# EAGLE design PlungerV3R7A (15cm x 2.5cm) (EAGLE 6.2)
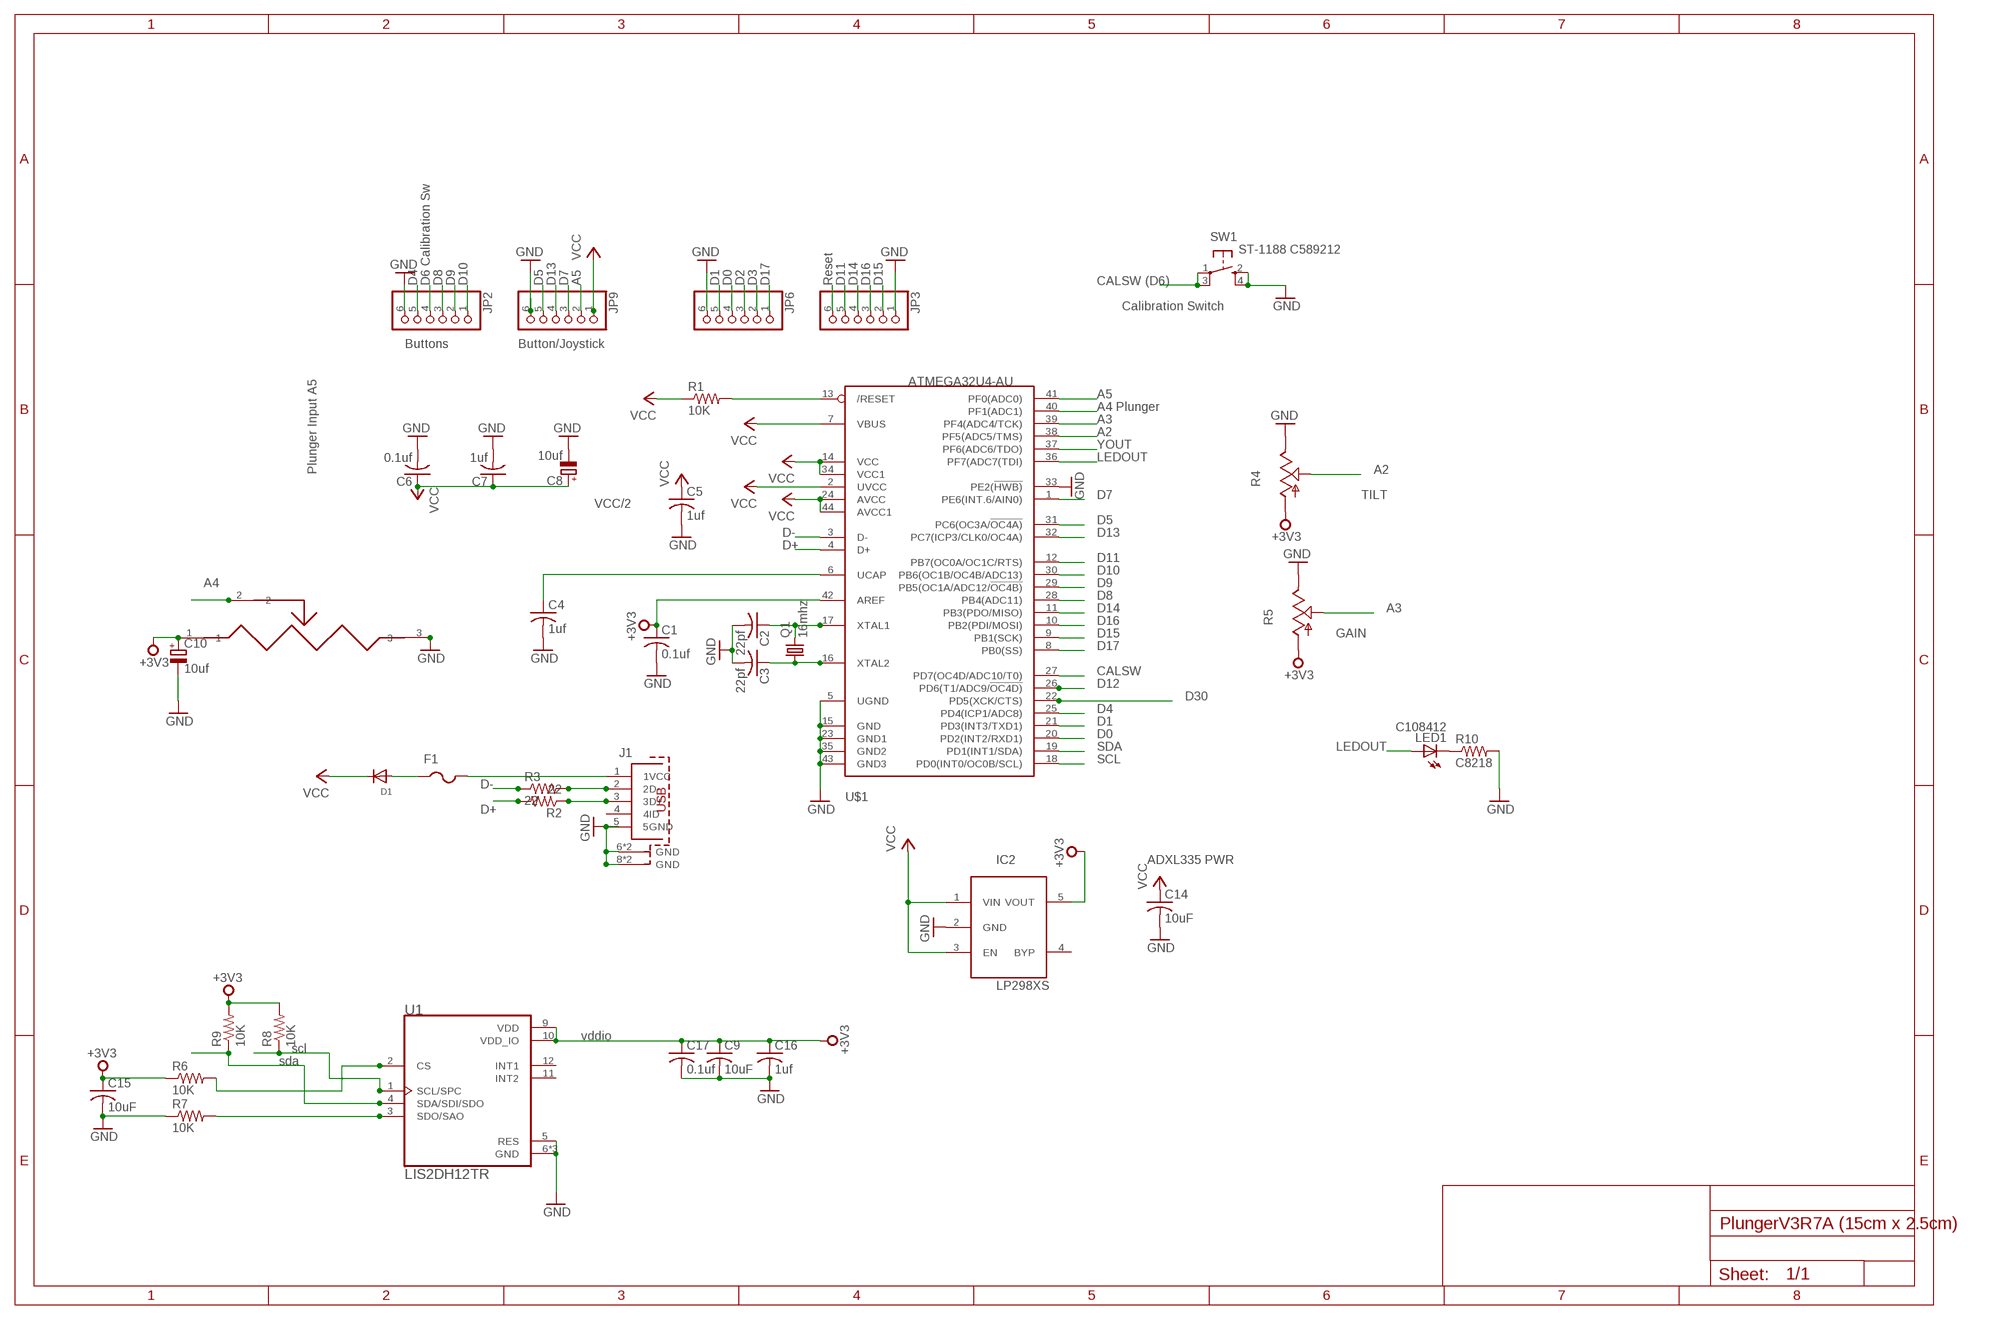
[diagram p0: schematic, sheet 1]

## Parts
C1  0.1uf  C-USC0603  [C0603]
C2  22pf  C-USC0603  [C0603]
C3  22pf  C-USC0603  [C0603]
C4  1uf  C-USC0603  [C0603]
C5  1uf  C-USC0603  [C0603]
C6  0.1uf  C-USC0603  [C0603]
C7  1uf  C-USC0603  [C0603]
C8  10uf  CPOL-EUA/3216-18W  [A/3216-18W]
C9  10uF  C-USC0805K  [C0805K]
C10  10uf  CPOL-EUA/3216-18W  [A/3216-18W]
C14  10uF  C-USC0805K  [C0805K]
C15  10uF  C-USC0805K  [C0805K]
C16  1uf  C-USC0603  [C0603]
C17  0.1uf  C-USC0603  [C0603]
D1  DIODESMA  [SMADIODE]
F1  PTCFUSE-1812  [1812]
IC2  LP298XS  [SOT23-5L]
J1  651005136521  [651005136521]
JP2  PINHD-1X6B  [1X06-BIG]
JP3  PINHD-1X6B  [1X06-BIG]
JP6  PINHD-1X6B  [1X06-BIG]
JP9  PINHD-1X6B  [1X06-BIG]
LED1  C108412  LEDCHIP-LED0805  [CHIP-LED0805]
Q1  16mhz  CRYSTALCTS406  [CTS406]
R1  10K  R-US_M0805  [M0805]
R2  22  R-US_R0603  [R0603]
R3  22  R-US_R0603  [R0603]
R4  TRIM_US-B25P  [B25P]
R5  TRIM_US-B25P  [B25P]
R6  10K  R-US_R0805  [R0805]
R7  10K  R-US_R0603  [R0603]
R8  10K  R-US_R0603  [R0603]
R9  10K  R-US_R0603  [R0603]
R10  C8218  R-US_M0805  [M0805]
SW1  ST-1188 C589212  SPST_TACT-KMR2  [KMR2]
U1  LIS2DH12TR  [PQFN50P200X200100-12N]
U$1  ATMEGA32U4-AU  [TQFP44]
U$7  PS100POTENTIOMETER  [PS100]

## Nets
+3V3: C1.1 C9.1 C10.+ C15.1 C16.1 C17.1 IC2.5(VOUT) R4.A R5.A R6.1 R8.2 R9.2 U1.9(VDD) U1.10(VDD_IO) U$1.42(AREF) U$7.1
A2: R4.S U$1.38(PF5(ADC5/TMS))
A3: R5.S U$1.39(PF4(ADC4/TCK))
A4: U$1.40(PF1(ADC1)) U$7.2
A5: JP9.2 U$1.41(PF0(ADC0))
CALSW: JP2.4 SW1.1(P) SW1.3(P1) U$1.27(PD7(OC4D/ADC10/T0))
D0: JP6.4 U$1.20(PD2(INT2/RXD1))
D1: JP6.5 U$1.21(PD3(INT3/TXD1))
D4: JP2.5 U$1.25(PD4(ICP1/ADC8))
D5: JP9.5 U$1.31(PC6(OC3A/!OC4A))
D7: JP9.3 U$1.1(PE6(INT.6/AIN0))
D8: JP2.3 U$1.28(PB4(ADC11))
D9: JP2.2 U$1.29(PB5(OC1A/ADC12/!OC4B))
D10: JP2.1 U$1.30(PB6(OC1B/OC4B/ADC13))
D11: JP3.5 U$1.12(PB7(OC0A/OC1C/RTS))
D12: U$1.26(PD6(T1/ADC9/!OC4D))
D13: JP9.4 U$1.32(PC7(ICP3/CLK0/OC4A))
D14: JP3.4 U$1.11(PB3(PDO/MISO))
D15: JP3.2 U$1.9(PB1(SCK))
D16: JP3.3 U$1.10(PB2(PDI/MOSI))
D17: JP6.1 U$1.8(PB0(SS))
D30: U$1.22(PD5(XCK/CTS))
D+: R2.2 U$1.4(D+)
D-: R3.1 U$1.3(D-)
GND: C1.2 C2.2 C3.2 C4.2 C5.2 C6.2 C7.2 C8.- C9.2 C10.- C14.2 C15.2 C16.2 C17.2 IC2.2(GND) J1.5(5GND) J1.6(GND) J1.7(GND) J1.8(GND) J1.9(GND) JP2.6 JP3.1 JP6.6 JP9.6 R4.E R5.E R7.1 R10.2 SW1.2(S) SW1.4(S1) U1.5(RES) U1.6(GND) U1.7(GND) U1.8(GND) U$1.5(UGND) U$1.15(GND) U$1.23(GND1) U$1.33(PE2(!HWB)) U$1.35(GND2) U$1.43(GND3) U$7.3
LEDOUT: LED1.A U$1.36(PF7(ADC7(TDI))
N$1: R7.2 U1.3(SDO/SAO)
N$2: C2.1 Q1.3 U$1.17(XTAL1)
N$3: C3.1 Q1.1 U$1.16(XTAL2)
N$4: J1.3(3D+) R2.1
N$5: C4.1 U$1.6(UCAP)
N$6: J1.2(2D-) R3.2
N$7: F1.2 J1.1(1VCC)
N$8: D1.A F1.1
N$9: R6.2 U1.2(CS)
N$10: LED1.C R10.1
RST: JP3.6 R1.2 U$1.13(/RESET)
SCL: JP6.2 R8.1 U1.1(SCL/SPC) U$1.18(PD0(INT0/OC0B/SCL))
SDA: JP6.3 R9.1 U1.4(SDA/SDI/SDO) U$1.19(PD1(INT1/SDA))
VCC: C5.1 C6.1 C7.1 C8.+ C14.1 D1.C IC2.1(VIN) IC2.3(EN) JP9.1 R1.1 U$1.2(UVCC) U$1.7(VBUS) U$1.14(VCC) U$1.24(AVCC) U$1.34(VCC1) U$1.44(AVCC1)
YOUT: U$1.37(PF6(ADC6/TDO))
Unconnected: IC2.4(BYP) J1.4(4ID) U1.11(INT2) U1.12(INT1)

## Notes on the sheet
- D4 | D6 Calibration Sw | D8 | D9 | D10 | D5 | D13 | D7 | A5 | D1 | D0 | D2 | D3 | D17 | Reset | D11 | D14 | D16 | D15 | CALSW (D6)
- Calibration Switch
- Buttons | Button/Joystick
- A5
- A4 Plunger
- A3
- A2
- YOUT
- LEDOUT
- Plunger Input A5 | A2
- VCC/2 | D7 | TILT
- D5
- D- | D13
- D+
- D11
- D10
- A4 | D9
- D8
- D14 | A3
- D16
- D15 | GAIN
- D17
- CALSW
- D12
- D30
- D4
- D1
- D0
- SDA | LEDOUT
- SCL
- D-
- D+
- ADXL335 PWR
- vddio
- scl
- sda

## Library data of the parts
C1-C3 C6 C9 C14 C15 C17 = adafruit:C-US: CAPACITOR, American symbol
C4 C5 C7 C16 = resistor:C-US: CAPACITOR, American symbol
C8 C10 = resistor:CPOL-EU: POLARIZED CAPACITOR, European symbol
D1 = adafruit:DIODE: Diode SMADIODE - SMA Surface Mount Package 20V 1A Schottky Diode Digikey: 641-1014-6-ND DO-1N4148 - Through Hole Small Current Diode SOD-123 20V 1 A (.5mV Vf) Schottky Diode - Digikey: MBRX120TPMSCT-ND SOD-323 10V 570mA (.38mV Vf, 3ns) Schottky Diode - Digikey: ZLLS410CT-ND SOD-523 30V 30mA Schottky Diode (RB751S-40TE61) - Digikey: RB751S-40TE61CT-ND SOT23-R/W - SOT23 Package (R = Solder Paste/Reflow Ovens, W = Hand-Soldering) BAT54Film 40V 300mA - Digikey: 497-7162-1-ND
F1 = adafruit:PTCFUSE: PTC fuses, resettable thermistors
IC2 = adafruit:LP298X
J1 = Wurth_Elektronik_Electromechanic_Input-Output_Connectors_rev16b:651005136521: WR-COM Horizontal 5 Contacts Mini USB Typ B=>Code : Con_I-O_COM_MiniUSB_651005136521 <http://katalog.we-online.de/media/images/eican/Con_I-O_COM_MiniUSB_651005136521_pf2.jpg> Details see: http://katalog.we-online.de/en/em/651_005_136_521 Created 2014-07-09, Karrer Zheng 2014 (C) Würth Elektronik
JP2 JP3 JP6 JP9 = adafruit:PINHD-1X6: PIN HEADER
LED1 = led:LED: LED OSRAM: - CHIPLED LG R971, LG N971, LY N971, LG Q971, LY Q971, LO R971, LY R971 LH N974, LH R974 LS Q976, LO Q976, LY Q976 LO Q996 - Hyper CHIPLED LW Q18S LB Q993, LB Q99A, LB R99A - SideLED LS A670, LO A670, LY A670, LG A670, LP A670 LB A673, LV A673, LT A673, LW A673 LH A674 LY A675 LS A676, LA A676, LO A676, LY A676, LW A676 LS A679, LY A679, LG A679 - Hyper Micro SIDELED® LS Y876, LA Y876, LO Y876, LY Y876 LT Y87S - SmartLED LW L88C, LW L88S LB L89C, LB L89S, LG L890 LS L89K, LO L89K, LY L89K LS L896, LA L896, LO L896, LY L896 - TOPLED LS T670, LO T670, LY T670, LG T670, LP T670 LSG T670, LSP T670, LSY T670, LOP T670, LYG T670 LG T671, LOG T671, LSG T671 LB T673, LV T673, LT T673, LW T673 LH T674 LS T676, LA T676, LO T676, LY T676, LB T676, LH T676, LSB T676, LW T676 LB T67C, LV T67C, LT T67C, LS T67K, LO T67K, LY T67K, LW E67C LS E67B, LA E67B, LO E67B, LY E67B, LB E67C, LV E67C, LT E67C LW T67C LS T679, LY T679, LG T679 LS T770, LO T770, LY T770, LG T770, LP T770 LB T773, LV T773, LT T773, LW T773 LH T774 LS E675, LA E675, LY E675, LS T675 LS T776, LA T776, LO T776, LY T776, LB T776 LHGB T686 LT T68C, LB T68C - Hyper Mini TOPLED® LB M676 - Mini TOPLED Santana® LG M470 LS M47K, LO M47K, LY M47K Source: http://www.osram.convergy.de LUXEON: - LUMILED® LXK2-PW12-R00, LXK2-PW12-S00, LXK2-PW14-U00, LXK2-PW14-V00 LXK2-PM12-R00, LXK2-PM12-S00, LXK2-PM14-U00 LXK2-PE12-Q00, LXK2-PE12-R00, LXK2-PE12-S00, LXK2-PE14-T00, LXK2-PE14-U00 LXK2-PB12-K00, LXK2-PB12-L00, LXK2-PB12-M00, LXK2-PB14-N00, LXK2-PB14-P00, LXK2-PB14-Q00 LXK2-PR12-L00, LXK2-PR12-M00, LXK2-PR14-Q00, LXK2-PR14-R00 LXK2-PD12-Q00, LXK2-PD12-R00, LXK2-PD12-S00 LXK2-PH12-R00, LXK2-PH12-S00 LXK2-PL12-P00, LXK2-PL12-Q00, LXK2-PL12-R00 Source: www.luxeon.com KINGBRIGHT: KA-3528ASYC Source: www.kingbright.com
Q1 = crystal:CRYSTAL: CRYSTAL; OC_FARNELL: unknown; OC_NEWARK: unknown
R1-R3 R6-R10 = resistor:R-US_: RESISTOR, American symbol
R4 R5 = pot:TRIM_US-: POTENTIOMETER
SW1 = adafruit:SPST_TACT: SMT 6mm switch, EVQQ2 series http://www.ladyada.net/library/eagle
U1 = LIS2DH12TR:LIS2DH12TR: MEMS digital output motion sensor: ultra low-power high performance 3-axes femto accelerometer Check prices <https://pricing.snapeda.com/parts/LIS2DH12TR/STMicroelectronics/view-part?ref=eda>; AVAILABILITY: In Stock; DESCRIPTION: Accelerometer X, Y, Z Axis ±2g, 4g, 8g, 16g 0.5Hz ~ 672Hz 12-LGA (2x2); MF: STMicroelectronics; MP: LIS2DH12TR; PACKAGE: LGA-12 STMicroelectronics; PRICE: None; PURCHASE-URL: https://pricing.snapeda.com/search/part/LIS2DH12TR/?ref=eda
U$1 = adafruit:ATMEGA32U4: http://www.ladyada.net/library/eagle
U$7 = PS100 POTENTIOMETER:PS100POTENTIOMETER

## Net classes
0 default: width 0.152 mm, clearance 0.203 mm

## Board
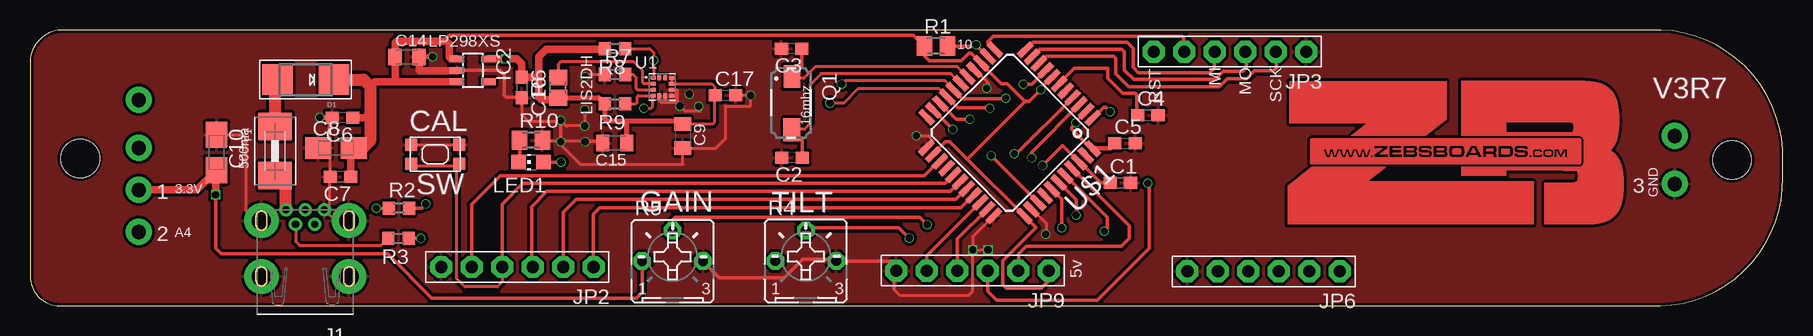
[diagram p1: board, top side]
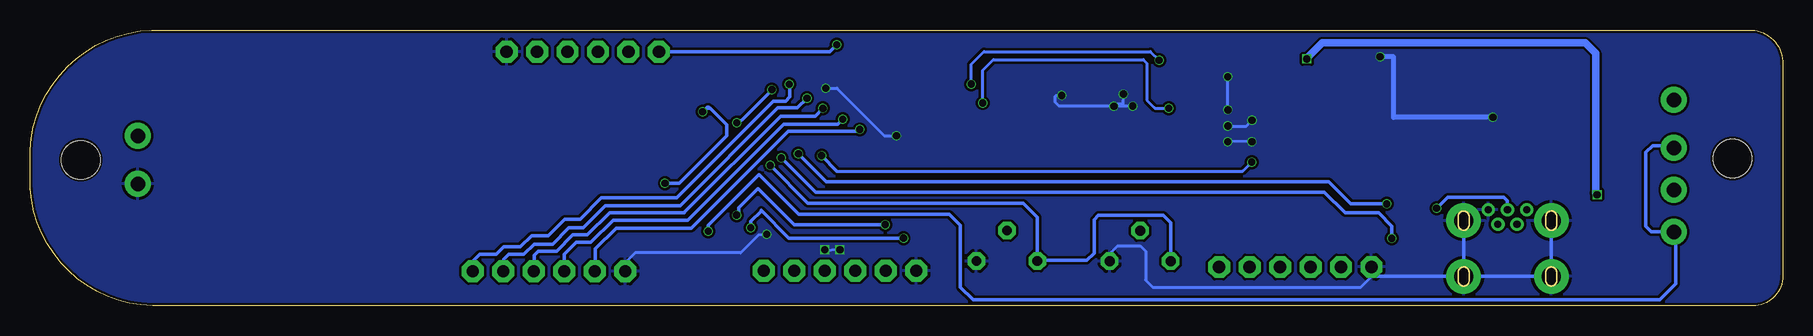
[diagram p2: board, bottom side, seen from below]

Size 146.06 x 22.98 mm. Coordinates in mm from the lower left corner, seen from the top.
Outline: 0,2.49 arc90 2.49,0 135.85,0 arc90 146.06,10.73 146.06,12.99 arc90 134.94,22.98 2.59,22.97 arc90 0,20.14 0,2.49
Copper layers (1*16): Top 0.035mm / dielectric 1.6mm / Bottom 0.035mm
Design rules: minimum track width 5mil, minimum drill 0.3mm, track to track 5mil, track to pad 5mil, pad to pad 5mil, via to via 5mil, smd to smd 5mil, copper to edge 0.2mm, drill to drill 6mil, minimum pad ring 10mil, minimum via ring 3mil, stop-mask expansion 4mil, vias tented up to drill 0mil, thermal gap 10mil
Holes 3.2 mm at 4.19,12.28 141.82,12.17

### Footprints (pad centres in the part's own frame; a part is rotated, then mirrored left to right if it is on the bottom)
C0603 = smd 1.1 x 1: 1 -0.85,0; 2 0.85,0
A/3216-18W = smd 2.15 x 1.8: + 1.475,0; - -1.475,0
C0805K = smd 1.1 x 1.4: 1 -1,0; 2 1,0
SMADIODE = smd 2.54 x 2.54: A 2.349,0; C -2.349,0
1812 = smd 2.286 x 2.794: 1 -2.046,0; 2 2.046,0
SOT23-5L = smd 0.55 x 1.2: 1 -0.95,-1.3; 2 0,-1.3; 3 0.95,-1.3; 4 0.95,1.3; 5 -0.95,1.3
651005136521 = drill 0.6: 1 1.6,-0.9; 2 0.8,0.3; 3 0,-0.9; 4 -0.8,0.3; 5 -1.6,-0.9 | drill 1.6: 6 -3.65,0; 7 -3.65,4.65; 8 3.65,4.65; 9 3.65,0
1X06-BIG = drill 1.016 pad 1.778 octagon: 1 -6.35,0; 2 -3.81,0; 3 -1.27,0; 4 1.27,0; 5 3.81,0; 6 6.35,0
CHIP-LED0805 = smd 1.2 x 1.2: A 0,-1.05; C 0,1.05
CTS406 = smd 1.9 x 1.4: 1 -2.2,0.07; 3 2.233,0.062
M0805 = smd 1.3 x 1.6: 1 -0.95,0; 2 0.95,0
R0603 = smd 1 x 1.1: 1 -0.85,0; 2 0.85,0
B25P = drill 0.813 octagon: A -2.54,0; E 2.54,0; S 0,2.54
R0805 = smd 1.3 x 1.5: 1 -0.85,0; 2 0.85,0
KMR2 = smd 1 x 1: 1 2,0.8; 2 2,-0.8; 3 -2,0.8; 4 -2,-0.8
PQFN50P200X200100-12N = smd 0.45 x 0.35: 1 -0.765,0.75; 2 -0.765,0.25; 3 -0.765,-0.25; 4 -0.765,-0.75; 7 0.765,-0.75; 8 0.765,-0.25; 9 0.765,0.25; 10 0.765,0.75 | smd 0.35 x 0.45: 5 -0.265,-0.765; 6 0.25,-0.765; 11 0.25,0.765; 12 -0.25,0.765
TQFP44 = smd 1.5 x 0.5: 1 -5.8,4; 2 -5.8,3.2; 3 -5.8,2.4; 4 -5.8,1.6; 5 -5.8,0.8; 6 -5.8,0; 7 -5.8,-0.8; 8 -5.8,-1.6; 9 -5.8,-2.4; 10 -5.8,-3.2; 11 -5.8,-4; 23 5.8,-4; 24 5.8,-3.2; 25 5.8,-2.4; 26 5.8,-1.6; 27 5.8,-0.8; 28 5.8,0; 29 5.8,0.8; 30 5.8,1.6; 31 5.8,2.4; 32 5.8,3.2; 33 5.8,4 | smd 0.5 x 1.5: 12 -4,-5.8; 13 -3.2,-5.8; 14 -2.4,-5.8; 15 -1.6,-5.8; 16 -0.8,-5.8; 17 0,-5.8; 18 0.8,-5.8; 19 1.6,-5.8; 20 2.4,-5.8; 21 3.2,-5.8; 22 4,-5.8; 34 4,5.8; 35 3.2,5.8; 36 2.4,5.8; 37 1.6,5.8; 38 0.8,5.8; 39 0,5.8; 40 -0.8,5.8; 41 -1.6,5.8; 42 -2.4,5.8; 43 -3.2,5.8; 44 -4,5.8
PS100 = drill 1.2: 1 0,-5.5; 2 0,-2; 3 -128,-6; P$1 -128,-10; P$5 0,-9; P$6 0,-13

### Placement (x,y rotation side)
C1  90.87,10.24 0 top
C2  63.5,12.36 180.1 top
C3  63.47,21.44 180 top
C4  93.16,15.9 0 top
C5  91.25,13.55 0 top
C6  26.05,15.68 180 top
C7  25.87,10.75 180 top
C8  25.49,13.16 0 top
C9  54.4,14.14 270 top
C10  15.54,12.78 270 top
C14  31.42,20.74 0 top
C15  48.73,13.57 180 top
C16  40.97,18.19 270 top
C17  57.96,17.54 0 top
D1  22.98,18.84 180 top
F1  20.42,12.9 270 top
IC2  36.9,19.62 270 top
J1  22.93,7.1 180 top
JP2  40.62,3.24 180 top
JP3  99.99,21.18 180 top
JP6  102.8,2.87 180 top
JP9  78.55,2.92 180 top
LED1  41.75,11.97 90 top
Q1  63.42,16.92 269.9 top
R1  75.5,21.65 0.1 top
R2  30.74,8.14 0 top
R3  30.69,5.62 180 top
R4  64.65,3.73 0 top
R5  53.54,3.72 0 top
R6  44.01,18.19 90 top
R7  48.75,19.27 0 top
R8  48.75,21.43 180 top
R9  48.74,16.83 180 top
R10  41.76,13.8 0 top
SW1  33.77,12.63 180 top
U1  52.69,18.25 0 top
U$1  81.64,14.42 224.7 top
U$2  [ZB_HUGE_COPPER]  118.5,13.34 0 top
U$7  9.06,4.17 180 top

### Tracks (layer width: path | path; a pad name or v marks a point on that pad's centre or on a via)
+3V3  (via drill 0.6)
  Top 0.254: 54.38,15.17 56.93,15.17 57.06,15.3 57.06,17.55 C17.1 57.06,17.56 57.06,18.27 56.83,18.5 U1.9 U1.10
  Top 0.305: v15.47,9.27 15.47,9.26 15.47,4.8 15.95,4.33 29.79,4.33 33.47,0.65 50.54,0.65 51.01,1.12 51.01,3.82 R5.A | v84.38,11.7 86.03,13.35 86.05,13.35 U$1.42 87.51,11.98 89.22,10.27 89.99,10.27 C1.1
  Top 0.406: 54.38,15.17 C9.1 54.13,15.41 49.59,15.41 | R6.1 47.38,17.34 R9.2 47.89,15.58 48.06,15.41 49.59,15.41 | C15.1 49.73,15.28 49.59,15.41
  Top 0.61: IC2.5 v39.66,20.57 | v39.66,20.57 | v15.47,9.27 15.47,11.23 C10.+ 13.9,9.67 U$7.1 | v39.66,20.57 40.56,20.57 40.97,20.16 C16.1 42.17,19.04 42.38,18.83 42.38,17.4 42.38,17.42 | R6.1 43.85,17.18 42.6,17.18 42.38,17.42 | 42.38,17.42 42.38,20.74 43.01,21.38 47.84,21.38 R8.2
  Bottom 0.254: 62.12,3.78 R4.A
  Bottom 0.305: 62.12,3.78 57.99,3.78 57.37,4.39 57.37,7.19 57.03,7.53 51.62,7.53 50.99,6.9 50.99,3.85 R5.A | R4.A 62.11,7.37 63.3,8.56 81.24,8.56 v84.38,11.7
  Bottom 0.61: v39.66,20.57 39.66,20.63 38.38,21.91 16.46,21.91 15.58,21.04 15.58,9.38 v15.47,9.27
A2  (via drill 0.6)
  Top 0.305: R4.S 65.04,6.32 65.22,6.5 72.4,6.5 v73.26,5.65 | v85.99,6.5 85.99,8.89 U$1.38
  Bottom 0.305: v73.26,5.65 82.82,5.65 85.13,7.96 85.13,7.89 85.99,7.03 v85.99,6.5
A3  (via drill 0.6)
  Top 0.305: R5.S 53.54,7.16 53.78,7.4 74.15,7.4 v74.78,6.77 | v87.17,7.56 87.17,8.84 U$1.39
  Bottom 0.305: v74.78,6.77 82.36,6.77 85.36,9.77 85.42,9.77 87.01,8.19 87.01,7.73 v87.17,7.56
A4  (via drill 0.6)
  Top 0.305: U$1.40 86.31,10.86 89.77,7.39 89.77,6.46 v89.52,6.21
  Bottom 0.305: U$7.2 10.94,6.17 11.39,6.62 11.39,12.78 10.82,13.35 9.11,13.35 9.05,13.29 | v89.52,6.21 89.52,6.73 85.32,10.94 85.29,10.94 81.98,7.63 69.45,7.63 68.52,6.71 68.52,1.55 67.46,0.49 10.23,0.49 8.89,1.82 8.89,5.99 U$7.2 | 9.18,6.05 U$7.2
A5
  Top 0.305: U$1.41 91.62,6.66 91.62,5.61 90.96,4.95 83.03,4.95 82.41,4.33 82.41,2.98 JP9.2
CALSW
  Top 0.254: JP2.4 39.35,2 38.94,1.59 36.24,1.59 35.55,2.26 35.55,11.63 | 35.55,11.63 SW1.3 | 35.55,11.63 31.96,11.63 SW1.1
  Top 0.305: U$1.27 76.26,10.21 41.08,10.21 39.35,8.48 JP2.4
D0  (via drill 0.6)
  Top 0.305: U$1.20 75.89,16.85 77.19,15.55 v78.33,15.55
  Bottom 0.305: JP6.4 101.55,2.89 101.55,4.28 100.55,5.28 99.31,5.28 97.46,7.13 91.22,7.13 83.22,15.13 78.74,15.13 v78.33,15.55
D1  (via drill 0.6)
  Top 0.305: U$1.21 75.31,16.29 v76.9,14.7
  Bottom 0.305: JP6.5 98.93,2.93 98.93,4.76 97.22,6.47 90.96,6.47 82.86,14.56 77.04,14.56 v76.9,14.7
D4
  Top 0.305: U$1.25 75.72,12.04 74.52,10.84 39.19,10.84 36.84,8.49 36.84,8.48 36.79,8.44 36.79,3.22 JP2.5 36.75,3.29
D5
  Top 0.305: JP9.5 74.74,4.17 U$1.31
D7  (via drill 0.6)
  Top 0.305: v90.01,16.17 89.63,16.55 89.47,16.55 U$1.1 | v93.14,10.22 93.26,10.11 93.26,4.78 88.95,0.47 80.56,0.47 79.82,1.22 JP9.3
  Bottom 0.305: v93.14,10.22 91.97,10.22 88.01,14.18 88.01,15.09 89.38,16.46 89.72,16.46 | 89.49,16.55 89.63,16.55 89.72,16.46 | 89.72,16.46 v90.01,16.17
D8
  Top 0.305: U$1.28 77.5,10.34 76.69,9.53 43.07,9.53 41.82,8.27 41.82,3.25 JP2.3
D9
  Top 0.305: U$1.29 78.01,9.77 77.14,8.9 45.52,8.9 44.44,7.82 44.44,3.29 JP2.2
D10
  Top 0.305: U$1.30 78.58,9.2 77.55,8.16 47.48,8.16 46.95,7.64 46.95,3.28 JP2.1
D11
  Top 0.305: U$1.12 79.82,21.93 79.82,22.02 80.28,22.48 95.98,22.48 96.16,22.3 96.16,21.2 JP3.5
D13
  Top 0.305: JP9.4 77.28,5.58 U$1.32
D14
  Top 0.305: U$1.11 | U$1.11 | U$1.11 83.55,21.95 91.45,21.95 91.92,21.47 91.92,19.86 92.35,19.43 98.32,19.43 98.69,19.8 98.69,21.15 JP3.4
D15
  Top 0.305: U$1.9 84.12,20.2 84.7,20.79 90.33,20.79 90.49,20.63 90.49,19.33 91.55,18.27 99.11,18.27 99.77,18.94 101.38,18.94 102.03,19.59 103.64,19.59 103.86,19.8 103.86,21.12 JP3.2
D16
  Top 0.305: U$1.10 83.52,20.77 84.14,21.39 90.97,21.39 91.2,21.16 91.2,19.63 91.96,18.86 98.75,18.86 99.44,19.55 101.07,19.55 101.34,19.82 101.34,21.1 JP3.3
D17  (via drill 0.6)
  Top 0.305: v82.79,18.46 83.47,18.46 U$1.8
  Bottom 0.305: JP6.1 109.15,3.7 108.57,4.28 107.2,4.28 106.58,4.9 105.2,4.9 104.25,5.85 102.88,5.85 101.5,7.23 100.22,7.23 98.46,8.99 92.17,8.99 84.1,17.06 83.07,17.06 82.73,17.41 82.73,18.4 v82.79,18.46
D+  (via drill 0.6)
  Top 0.305: R2.2 32.63,8.14 v32.98,8.49 | v82.02,12.67 82.19,12.67 U$1.4
  Bottom 0.305: v32.98,8.49 35.99,8.49 37.84,10.34 79.7,10.34 v82.02,12.67
D-  (via drill 0.6)
  Top 0.305: R3.1 32.56,5.62 v32.57,5.62 | v83.46,12.32 83.46,12.8 U$1.3
  Bottom 0.305: v32.57,5.62 32.57,6.64 33.67,7.74 36.47,7.74 38.18,9.45 80.58,9.45 v83.46,12.32
GND  (via drill 0.6)
  Top 0.254: C6.2 24.94,15.43 24.94,13.97 24.13,13.16 C8.- 25.02,12.16 C7.2 24.94,10.68 24.94,8.41 J1.5 25.43,7.1 J1.6 26.61,7.12 | C10.- 17.65,14.26 17.96,13.95 17.96,7.94 J1.9 | U$1.15 78.75,19.66 79.83,18.58 79.83,18.23 v79.74,18.13 | v73.85,14.17 74.82,14.17 75.26,13.72 75.24,13.72 U$1.23 | U$1.35 83.49,8.04 84.67,6.86 84.67,6.01 v84.66,5.97 | v46.25,19.09 46.43,19.27 R7.1 46.43,19.27 v46.25,19.1 | v46.23,14.98 v46.23,16.32 46.25,16.3 46.25,15.04 46.22,15.01 44.76,15.01 44.73,14.97 44.68,14.97 44.19,15.46 44.19,13.83 44.27,13.75 44.27,13.37 45.84,11.8 54.36,11.8 54.4,11.83 C9.2 57.14,13.14 57.97,13.97 57.97,16.58 57.9,16.64 60.04,16.64 60.04,17.5 v60.07,17.53 C17.2 | v44.23,13.68 44.22,13.81 v44.22,15.46 44.16,15.39 41.53,15.39 40.97,15.95 C16.2 | v46.26,13.68 47.59,13.71 C15.2 47.41,13.57 47.28,13.7 42.8,13.7 R10.2 | 54.93,17.83 v54.93,17.65 | v55.73,16.63 55.84,16.2 54.61,16.2 v54.16,16.64 | U1.5 52.43,17.1 52.56,16.97 52.94,16.97 | 52.94,16.97 53.84,16.97 v54.16,16.64 | U1.8 53.91,18 53.94,17.97 53.94,17.48 | 53.94,17.48 53.94,16.86 v54.16,16.64 | U1.7 53.93,17.5 53.94,17.48 | U1.6 52.94,16.97 | U$1.33 78.55,5.76 78.55,4.59 v78.56,4.67 | 72.13,2.85 JP9.6 72.01,2.74 72.01,1.34 72.51,0.85 78.21,0.85 78.54,1.18 78.54,4.53 78.61,4.6 v79.83,4.67 | SW1.2 SW1.4
  Top 0.305: IC2.2 39.13,19.62 39.51,19.24 39.51,17.57 39.7,17.37 40.93,17.37 C16.2 | R5.E 56.08,3.69 57.43,2.34 62.84,2.34 64.38,3.88 67.09,3.88 R4.E 72.11,3.73 JP9.6
  Top 0.406: 54.4,13.1 C9.2 | C6.2 24.23,15.68 v24.14,15.71 | v33.55,20.76 32.42,20.76 C14.2
  Top 0.61: C14.2 32.42,19.64 32.46,19.6 35.58,19.6 IC2.2
  Bottom 0.254: v79.74,18.13 78.82,18.13 74.86,14.17 v73.85,14.17 | v84.66,5.97 85.38,5.88 86.84,4.42 95.63,4.42 96.48,3.57 96.48,2.9 JP6.6 | v46.23,16.32 46.25,16.34 v46.25,19.09 | v46.23,14.98 44.7,14.98 v44.22,15.46 | v44.23,13.68 46.07,13.7 v46.26,13.68 | v54.93,17.65 55.01,16.8 55.83,16.8 v55.73,16.63 | v54.16,16.64 60.3,16.64 60.61,16.96 60.61,17.46 60.55,17.53 v60.07,17.53 | R5.E 56.08,4.34 55.43,5 53.54,5 53.1,4.55 53.1,2.15 52.51,1.56 35.15,1.56 34.26,2.45 | 72.08,2.8 JP9.6 | v78.56,4.67 79.96,4.59 v79.83,4.67
  Bottom 0.305: J1.9 J1.8 J1.7 | J1.7 J1.6 | J1.7 34.26,2.45 JP2.6
  Bottom 0.406: v24.14,15.71 32.42,15.7 C14.2 33.55,20.74 v33.55,20.76
  pour Top (isolate 0.254): 0.08,25.44 148.68,25.44 148.68,-2.07 -1.4,-2.07 -1.4,25.44
  pour Bottom: -0.29,24.36 147.36,24.36 147.36,-2.62 -0.3,-2.62
LEDOUT  (via drill 0.6)
  Top 0.305: U$1.36 v80.09,12.52 | v44.25,11.98 LED1.A
  Bottom 0.254: 78.82,11.22 45.01,11.22 v44.25,11.98
  Bottom 0.305: v80.09,12.52 80.09,12.5 78.82,11.22
N$1
  Top 0.254: U1.3 51.9,17.97 50.66,17.97 50.54,18.1 50.54,19.01 50.28,19.27 R7.2
N$2
  Top 0.254: 77.56,18.63 77.48,18.63 76.75,19.36 65.94,19.36 65.02,18.44 65.02,15.21 64.52,14.71 63.51,14.71 Q1.3
  Top 0.305: C2.1 64.35,13.82 Q1.3 63.5,14.66 | U$1.17 77.56,18.63
N$3
  Top 0.254: 78.13,19.11 78.1,19.11 77.29,19.92 65.44,19.92 64.47,18.96 63.66,18.96 Q1.1
  Top 0.305: C3.1 64.32,19.94 Q1.1 | U$1.16 78.13,19.11
N$4  (via drill 0.6 pad 0.25)
  Top 0.254: v28.84,8.13 29.88,8.13 R2.1
  Bottom 0.305: J1.3 22.93,8.76 23.23,9.05 27.92,9.05 v28.84,8.13
N$5
  Top 0.305: U$1.6 85.76,18.54 87.03,19.81 89.79,19.81 89.8,19.8 89.8,18.98 91.06,17.72 92.12,17.72 92.24,17.6 92.24,15.97 C4.1 92.32,15.91
N$6
  Top 0.254: J1.2 22.13,5.38 22.47,5.04 29.26,5.04 R3.2
  Top 0.305: 29.55,5.33 R3.2
N$7
  Top 1.016: J1.1 21.33,9.94 F1.2
N$8
  Top 1.016: F1.1 20.42,18.63 D1.A
N$9
  Top 0.254: U1.2 51.15,18.5 51.05,18.6 51.05,19.59 50.32,20.32 44.22,20.32 44,20.11 R6.2
N$10
  Top 0.305: R10.1 40.81,12.08 LED1.C
RST  (via drill 0.6)
  Top 0.305: U$1.13 79.81,20.79 78.95,21.65 | 78.95,21.65 R1.2 | v78.84,21.74 78.91,21.67 78.95,21.65
  Bottom 0.305: v78.84,21.74 79.43,21.19 JP3.6
SCL  (via drill 0.6)
  Top 0.254: U$1.18 76.99,18 76.25,18.74 67.89,18.74 v67.63,18.48 | U1.1 51.97,19.04 v51.97,20.46 51.97,21.1 51.63,21.43 R8.1
  Top 0.305: U$1.18 77.1,17.98 77.1,17.88 77.62,17.36 77.62,17.35 77.7,17.27 81.27,17.27 v81.31,17.3
  Bottom 0.254: v67.63,18.48 67.63,20.13 66.57,21.19 52.7,21.19 v51.97,20.46
  Bottom 0.305: JP6.2 106.59,2.9 106.59,3.86 106.16,4.29 104.91,4.29 104.05,5.15 102.5,5.15 101.15,6.5 99.96,6.5 98.12,8.35 91.87,8.35 83.74,16.49 82.12,16.49 v81.31,17.3
SDA  (via drill 0.6)
  Top 0.254: R9.1 50.48,16.83 50.58,16.94 50.58,17.42 50.68,17.51 51.92,17.51 U1.4 51.89,17.46 51.89,16.59 51.75,16.45 v51.16,16.45 | U$1.19 76.42,17.44 75.78,18.08 69,18.08 67.82,16.9 v66.67,16.9
  Top 0.305: U$1.19 76.42,17.39 77.3,16.51 79.91,16.51 v79.98,16.45
  Bottom 0.254: v66.67,16.9 66.67,19.61 65.77,20.51 53.28,20.51 52.98,20.2 52.98,17.14 52.32,16.48 51.19,16.48 v51.16,16.45
  Bottom 0.305: JP6.3 104.02,2.93 104.02,4.23 103.69,4.56 102.17,4.56 100.82,5.91 99.6,5.91 97.75,7.76 91.53,7.76 91.53,7.78 83.51,15.8 80.62,15.8 v79.98,16.45
VCC  (via drill 0.6)
  Top 0.305: 90.39,13.43 90.07,13.11 U$1.44 89.96,13.11 C5.1 90.35,13.6 90.35,13.45 90.09,13.19 88.64,13.19 88.6,13.15 88.39,13.15 86.81,14.73 86.81,14.9 v87.17,15.26 87.2,15.41 U$1.2 88.01,16.28 88.21,16.28 | U$1.7 85.15,19.07 84.38,18.3 84.38,17.86 v84.23,18.02 83.25,17.04 82.88,17.04 | U$1.24 75.26,12.67 76.29,13.69 76.66,13.69 78.12,12.23 | 78.12,12.23 U$1.34 | 82.88,17.04 81.42,18.5 80.93,18.5 79.26,20.16 U$1.14 78.44,21.05 78.24,21.05 77.6,20.41 74.94,20.41 74.55,20.8 R1.1 74.36,21.64 74.36,21.8 73.62,22.54 34.95,22.54 34.46,22.05 | 82.88,17.04 82.88,16.98 78.12,12.23 | U$1.34 82.87,7.38 | JP9.1 84.9,2.08 84.29,1.46 81.36,1.46 81.08,1.75 81.08,3.77 83.81,6.51 83.81,6.54 U$1.34
  Top 0.61: C6.1 28.06,15.68 28.34,15.96 | C7.1 26.72,12.91 C8.+ | IC2.3 30.53,18.67 | 30.53,18.67 28.71,18.67 28.34,18.31 | 30.53,18.67 30.42,18.77 C14.1 30.42,21.91 30.56,22.05 34.46,22.05 34.7,22.05 34.92,21.83 34.92,20.7 35.05,20.57 IC2.1
  Top 1.016: D1.C 27.81,18.84 28.34,18.31 28.34,15.96 28.34,13.74 27.74,13.14 26.99,13.14 C8.+
  Bottom 0.305: v84.23,18.02 84.37,17.85 86.71,15.51 | 86.71,15.51 | 86.71,15.51 86.81,15.41 v87.17,15.26

### Text on the board
tPlace: LP298XS | 10 | RST | MI | MO | SCK | V3R7 | LIS2DH | CAL | 16mhz | 500ma | 3.3V | SW | GND | GAIN | TILT | A4 | 5v